# Altium project vme_can_pcb_v4.PrjPcb (part 1 of 2)
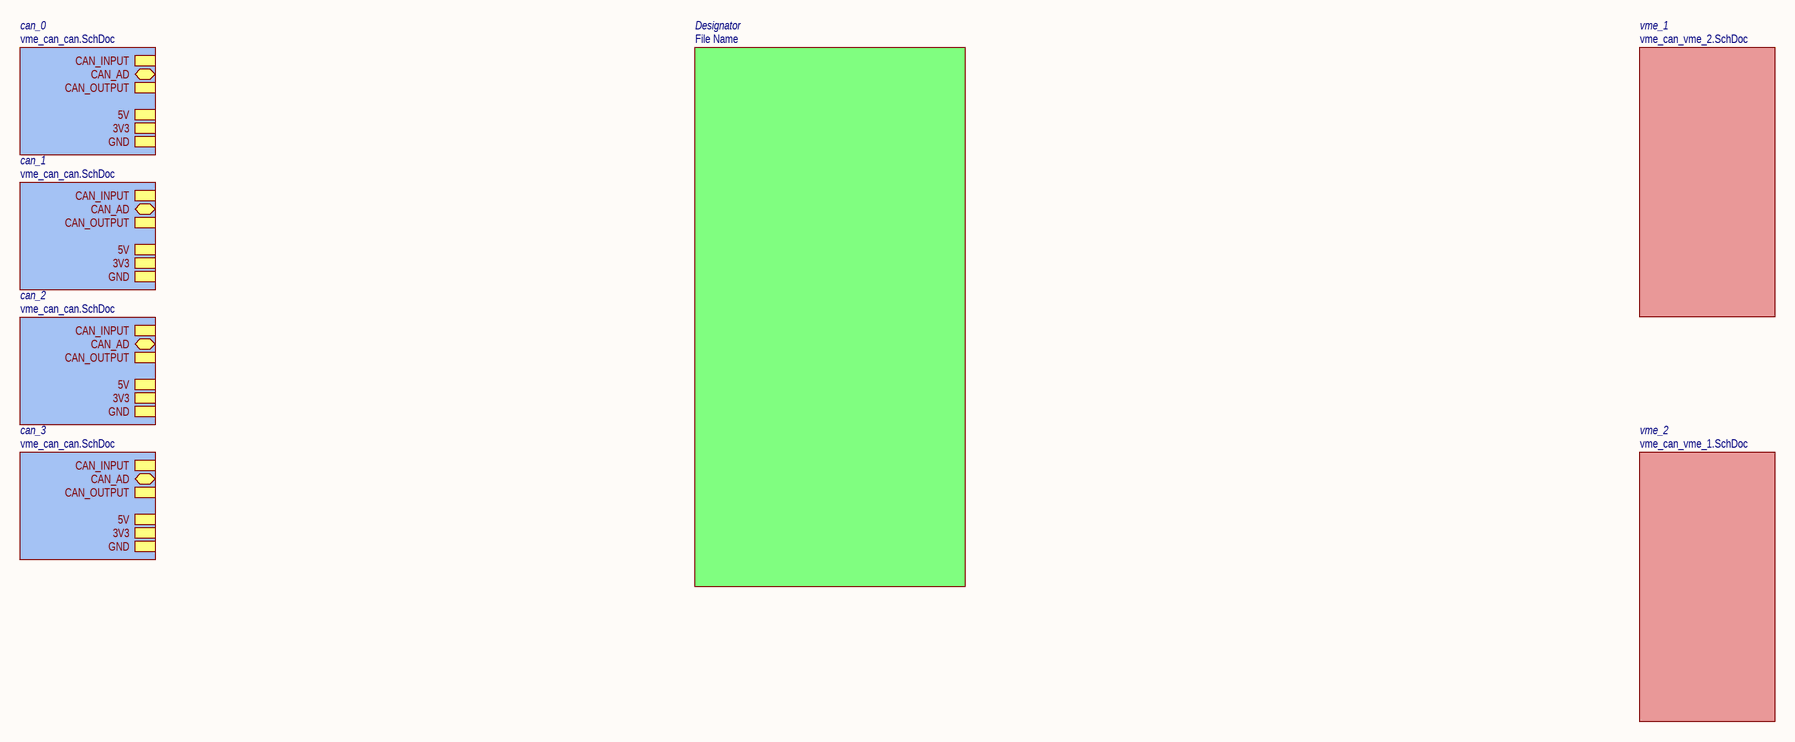
[diagram p0: vme_can_main.SchDoc]
8 sheets, 377 parts. Net scope: hierarchical (ports join the sheet entries above them; power ports are global).
Board file: vme_can.PcbDoc
Sheets:
  vme_can_main.SchDoc
    can_0 = vme_can_can.SchDoc
    can_1 = vme_can_can.SchDoc
    can_2 = vme_can_can.SchDoc
    can_3 = vme_can_can.SchDoc
    vme_1 = vme_can_vme_2.SchDoc
    vme_2 = vme_can_vme_1.SchDoc
  vme_can_fpga.SchDoc
    fpga_io = vme_can_fpga_bridge.SchDoc
    fpga_pwr = vme_can_fpga_pwr.SchDoc
    fpga_conf_per = vme_can_fpga_conf.SchDoc

## Sheet vme_can_main.SchDoc: =GlobalProjectName
size 410 x 297 mm; SheetNumber: 1; SheetTotal: 8; PageSetup: Record=PageOptions|CenterHorizontal=True|CenterVertical=True|PrintScale=1.00|XCorrection=1.00|YCorrection=1.00|PrintKind=1|BorderSize=5000000|LeftOffset=0|BottomOffset=0|Orientation=2|PaperLength=1000|PaperWidth=1000|Scale=100|PaperSource=15|PrintQuality=1200|MediaType=1|DitherType=10|PaperKind=A3|PrintScaleMode=1; Weight: -; ScaleFactor: -

### Sub-sheets
can_0 = vme_can_can.SchDoc: 5V, GND, CAN_AD (bidir), CAN_INPUT (harness FPGA_CAN_INPUT), 3V3, CAN_OUTPUT (harness FPGA_CAN_OUPUT)
can_1 = vme_can_can.SchDoc: 5V, GND, CAN_AD (bidir), CAN_INPUT (harness FPGA_CAN_INPUT), 3V3, CAN_OUTPUT (harness FPGA_CAN_OUPUT)
can_2 = vme_can_can.SchDoc: 5V, GND, CAN_AD (bidir), CAN_INPUT (harness FPGA_CAN_INPUT), 3V3, CAN_OUTPUT (harness FPGA_CAN_OUPUT)
can_3 = vme_can_can.SchDoc: 5V, GND, CAN_AD (bidir), CAN_INPUT (harness FPGA_CAN_INPUT), 3V3, CAN_OUTPUT (harness FPGA_CAN_OUPUT)
Designator = File Name (file not in this document): no entries
vme_1 = vme_can_vme_2.SchDoc: no entries
vme_2 = vme_can_vme_1.SchDoc: no entries

### Nets
3V3: sheet can_0/3V3, sheet can_1/3V3, sheet can_2/3V3, sheet can_3/3V3
5V: sheet can_0/5V, sheet can_1/5V, sheet can_2/5V, sheet can_3/5V
GND: sheet can_0/GND, sheet can_1/GND, sheet can_2/GND, sheet can_3/GND

### Notes on the sheet
- Перв. примен.
- Справ. №
- Подп. и дата
- Инв. № дубл.
- Взам. инв. №
- Изм.
- Разраб.
- Лист
- № докум.
- Подп.
- Дата
- Литера
- Масса
- Масштаб
- Пров.
- Т.контр.
- Листов
- Н.контр.
- Утв.
- Инв. № подл.
- Форма 1 ГОСТ 2.104-2006
- Копировал
- Формат А3

## Sheet vme_can_can.SchDoc: =GlobalProjectName
size 410 x 297 mm; SheetNumber: 2; SheetTotal: 8; PageSetup: Record=PageOptions|CenterHorizontal=True|CenterVertical=True|PrintScale=1.00|XCorrection=1.00|YCorrection=1.00|PrintKind=1|BorderSize=5000000|LeftOffset=0|BottomOffset=0|Orientation=2|PaperLength=1000|PaperWidth=1000|Scale=100|PaperSource=15|PrintQuality=1200|MediaType=1|DitherType=10|PaperKind=A3|PrintScaleMode=1; Weight: -; ScaleFactor: -
Used 4 times, as channels can_0, can_1, can_2, can_3. Parts and nets are listed once, with the designators drawn on the sheet.
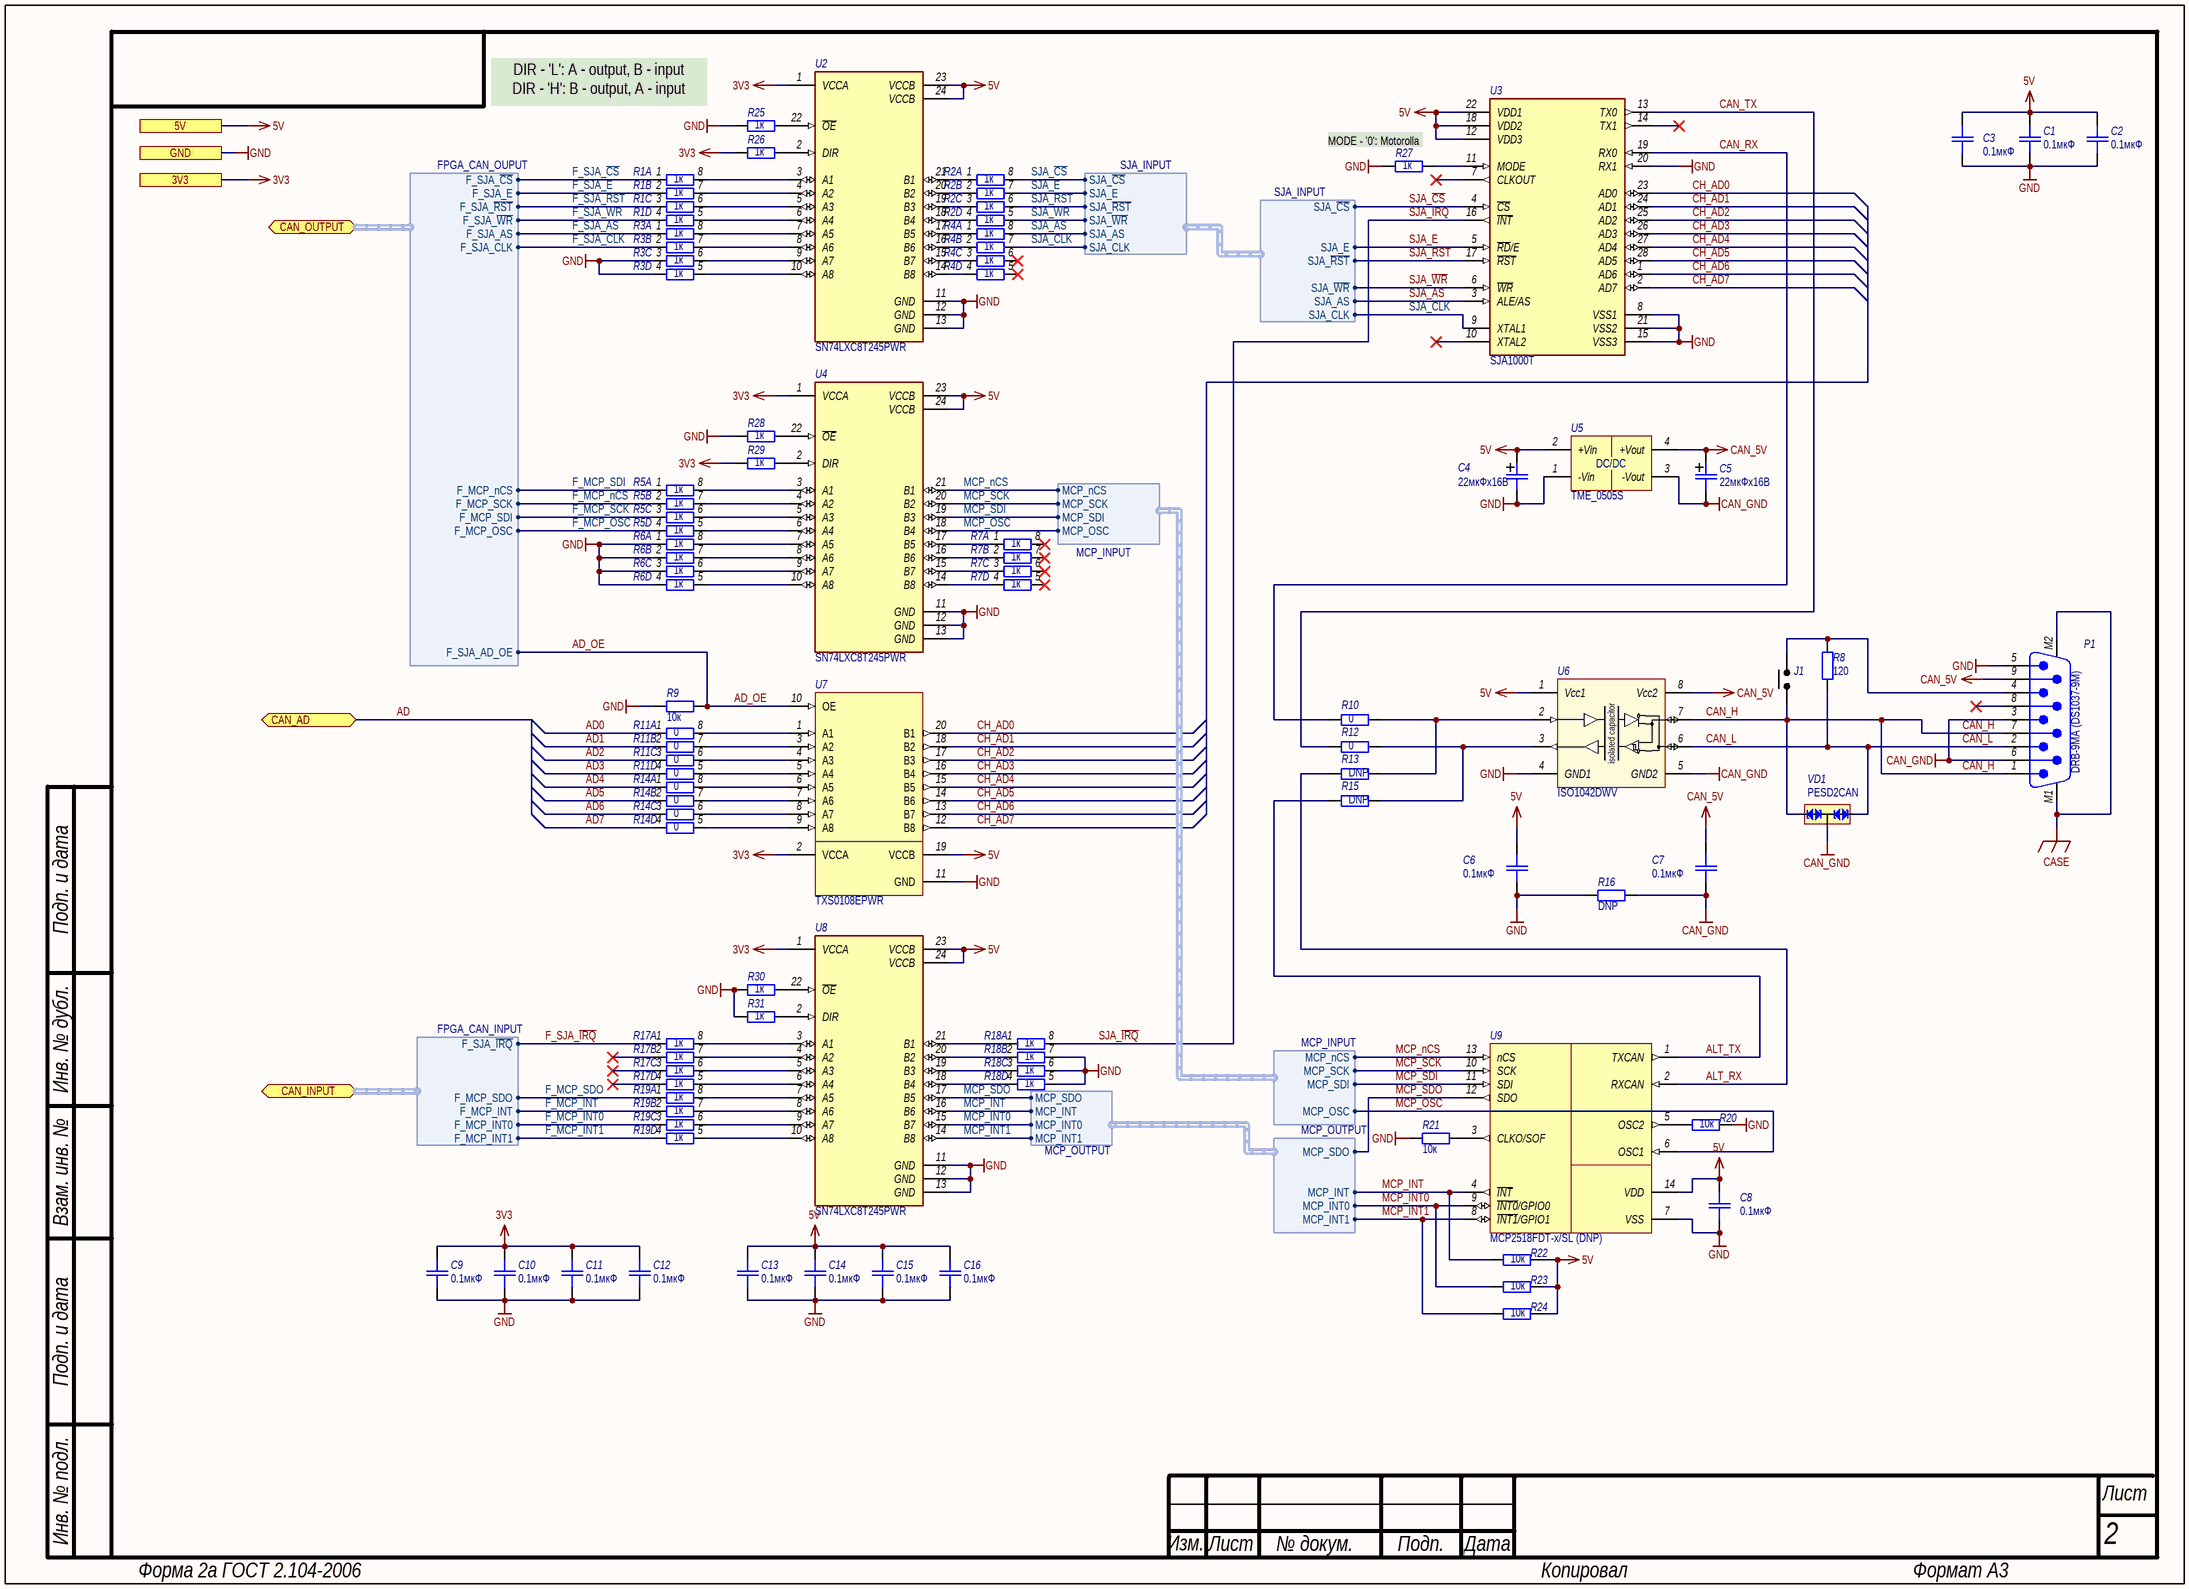
[diagram p1: vme_can_can.SchDoc]

### Parts
C1  0.1мкФ  [SMD_C0805]
C2  0.1мкФ  [SMD_C0805]
C3  0.1мкФ  [SMD_C0805]
C4  value 22мкФх16В  [SMD_size_B]  (hidden comment: OS K53-68)
C5  value 22мкФх16В  [SMD_size_B]  (hidden comment: OS K53-68)
C6  0.1мкФ  [SMD_C0805]
C7  0.1мкФ  [SMD_C0805]
C8  0.1мкФ  [SMD_C0805]
C9  0.1мкФ  [SMD_C0805]
C10  0.1мкФ  [SMD_C0805]
C11  0.1мкФ  [SMD_C0805]
C12  0.1мкФ  [SMD_C0805]
C13  0.1мкФ  [SMD_C0805]
C14  0.1мкФ  [SMD_C0805]
C15  0.1мкФ  [SMD_C0805]
C16  0.1мкФ  [SMD_C0805]
J1  Jumper 2  [PLS-2]  (value not drawn)
P1  Наименование: DRB-9MA (DS1037-9M)  [DRB-9MA]  (hidden comment: DRB-9MA)
R1  value 1к  [TC124]  (hidden comment: 4 Chip Resistor Array)  (parts A,B,C,D of 4)
R2  value 1к  [TC124]  (hidden comment: 4 Chip Resistor Array)  (parts A,B,C,D of 4)
R3  value 1к  [TC124]  (hidden comment: 4 Chip Resistor Array)  (parts A,B,C,D of 4)
R4  value 1к  [TC124]  (hidden comment: 4 Chip Resistor Array)  (parts A,B,C,D of 4)
R5  value 1к  [TC124]  (hidden comment: 4 Chip Resistor Array)  (parts A,B,C,D of 4)
R6  value 1к  [TC124]  (hidden comment: 4 Chip Resistor Array)  (parts A,B,C,D of 4)
R7  value 1к  [TC124]  (hidden comment: 4 Chip Resistor Array)  (parts A,B,C,D of 4)
R8  120  [SMD_0805]
R9  10к  [SMD_0805]
R10  0  [SMD_0805]
R11  value 0  [TC124]  (hidden comment: 4 Chip Resistor Array)  (parts A,B,C,D of 4)
R12  0  [SMD_0805]
R13  DNP  [SMD_0805]
R14  value 0  [TC124]  (hidden comment: 4 Chip Resistor Array)  (parts A,B,C,D of 4)
R15  DNP  [SMD_0805]
R16  DNP  [SMD_0805]
R17  value 1к  [TC124]  (hidden comment: 4 Chip Resistor Array)  (parts A,B,C,D of 4)
R18  value 1к  [TC124]  (hidden comment: 4 Chip Resistor Array)  (parts A,B,C,D of 4)
R19  value 1к  [TC124]  (hidden comment: 4 Chip Resistor Array)  (parts A,B,C,D of 4)
R20  10к  [SMD_0805]
R21  10к  [SMD_0805]
R22  10к  [SMD_0805]
R23  10к  [SMD_0805]
R24  10к  [SMD_0805]
R25  1к  [SMD_0805]
R26  1к  [SMD_0805]
R27  1к  [SMD_0805]
R28  1к  [SMD_0805]
R29  1к  [SMD_0805]
R30  1к  [SMD_0805]
R31  1к  [SMD_0805]
U2  SN74LXC8T245PWR  [TSSOP-24]
U3  SJA1000T  [SO28]
U4  SN74LXC8T245PWR  [TSSOP-24]
U5  TME_0505S  [PCBComponent_1]
U6  Наименование: ISO1042DWV  [SOIC-8-WIDE]  (hidden comment: ISO1042)
U7  TXS0108EPWR  [TSSOP-20]
U8  SN74LXC8T245PWR  [TSSOP-24]
U9  Наименование: MCP2518FDT-x/SL (DNP)  [SOIC-14]  (hidden comment: MCP2518FDT-x/SL)
VD1  PESD2CAN  [SOT-23]

### Ports
3V3, 5V, CAN_AD (bidir), CAN_INPUT (bidir, harness FPGA_CAN_INPUT), CAN_OUTPUT (bidir, harness FPGA_CAN_OUPUT), GND

### Harnesses
SJA_INPUT: SJA_~{CS}, SJA_E, SJA_~{RST}, SJA_~{WR}, SJA_AS, SJA_CLK
MCP_INPUT: MCP_nCS, MCP_SCK, MCP_SDI, MCP_OSC
MCP_OUTPUT: MCP_SDO, MCP_INT, MCP_INT0, MCP_INT1
FPGA_CAN_OUPUT: F_SJA_~{CS}, F_SJA_E, F_SJA_~{RST}, F_SJA_~{WR}, F_SJA_AS, F_MCP_nCS, F_MCP_SCK, F_MCP_SDI, F_SJA_AD_OE, F_MCP_OSC, F_SJA_CLK
FPGA_CAN_INPUT: F_SJA_~{IRQ}, F_MCP_SDO, F_MCP_INT, F_MCP_INT0, F_MCP_INT1

### Nets
3V3: C9.2 C10.2 C11.2 C12.2 R26.2 R29.2 U2.1(VCCA) U4.1(VCCA) U7.2(VCCA) U8.1(VCCA) ; port 3V3
5V: C1.2 C2.2 C3.2 C4.1 C6.2 C8.2 C13.2 C14.2 C15.2 C16.2 R22.1 R23.1 R24.1 U2.23(VCCB) U2.24(VCCB) U3.12(VDD3) U3.18(VDD2) U3.22(VDD1) U4.23(VCCB) U4.24(VCCB) U5.2(+Vin) U6.1(Vcc1) U7.19(VCCB) U8.23(VCCB) U8.24(VCCB) U9.14(VDD) ; port 5V
CAN_5V: C5.1 C7.2 P1.9 U5.4(+Vout) U6.8(Vcc2)
CAN_GND: C5.2 C7.1 P1.3 P1.6 R16.1 U5.3(-Vout) U6.5(GND2) VD1.3(CC)
CASE: P1.M1 P1.M2
GND: C1.1 C2.1 C3.1 C4.2 C6.1 C8.1 C9.1 C10.1 C11.1 C12.1 C13.1 C14.1 C15.1 C16.1 P1.5 R3.3 R3.4 R6.1 R6.2 R6.3 R6.4 R9.2 R16.2 R18.5 R18.6 R18.7 R20.1 R21.1 R25.2 R27.2 R28.2 R30.2 R31.2 U2.11(GND) U2.12(GND) U2.13(GND) U3.8(VSS1) U3.15(VSS3) U3.20(RX1) U3.21(VSS2) U4.11(GND) U4.12(GND) U4.13(GND) U5.1(-Vin) U6.4(GND1) U7.11(GND) U8.11(GND) U8.12(GND) U8.13(GND) U9.7(VSS) ; port GND
AD0: R11.1
AD1: R11.2
AD2: R11.3
AD3: R11.4
AD4: R14.1
AD5: R14.2
AD6: R14.3
AD7: R14.4
AD_OE: R9.1 U7.10(OE) ; port CAN_OUTPUT.F_SJA_AD_OE
ALT_RX: R13.2 U9.2(RXCAN)
ALT_TX: R15.2 U9.1(TXCAN)
CAN_H: J1.1 P1.1 P1.7 U6.7(CANH) VD1.2(C2)
CAN_L: P1.2 R8.1 U6.6(CANL) VD1.1(C1)
CAN_RX: R10.2 U3.19(RX0)
CAN_TX: R12.2 U3.13(TX0)
CH_AD0: U3.23(AD0) U7.20(B1)
CH_AD1: U3.24(AD1) U7.18(B2)
CH_AD2: U3.25(AD2) U7.17(B3)
CH_AD3: U3.26(AD3) U7.16(B4)
CH_AD4: U3.27(AD4) U7.15(B5)
CH_AD5: U3.28(AD5) U7.14(B6)
CH_AD6: U3.1(AD6) U7.13(B7)
CH_AD7: U3.2(AD7) U7.12(B8)
F_MCP_INT: R19.2 ; port CAN_INPUT.F_MCP_INT
F_MCP_INT0: R19.3 ; port CAN_INPUT.F_MCP_INT0
F_MCP_INT1: R19.4 ; port CAN_INPUT.F_MCP_INT1
F_MCP_nCS: R5.2 ; port CAN_OUTPUT.F_MCP_SCK
F_MCP_OSC: R5.4 ; port CAN_OUTPUT.F_MCP_OSC
F_MCP_SCK: R5.3 ; port CAN_OUTPUT.F_MCP_SDI
F_MCP_SDI: R5.1 ; port CAN_OUTPUT.F_MCP_nCS
F_MCP_SDO: R19.1 ; port CAN_INPUT.F_MCP_SDO
F_SJA_AS: R3.1 ; port CAN_OUTPUT.F_SJA_AS
F_SJA_~{CS}: R1.1 ; port CAN_OUTPUT.F_SJA_~{CS}
F_SJA_CLK: R3.2 ; port CAN_OUTPUT.F_SJA_CLK
F_SJA_E: R1.2 ; port CAN_OUTPUT.F_SJA_E
F_SJA_~{IRQ}: R17.1 ; port CAN_INPUT.F_SJA_~{IRQ}
F_SJA_~{RST}: R1.3 ; port CAN_OUTPUT.F_SJA_~{RST}
F_SJA_~{WR}: R1.4 ; port CAN_OUTPUT.F_SJA_~{WR}
MCP_INT: R22.2 U8.16(B6) U9.4(~{INT}) ; harness MCP_OUTPUT.MCP_INT
MCP_INT0: R23.2 U8.15(B7) U9.9(~{INT0}/GPIO0) ; harness MCP_OUTPUT.MCP_INT0
MCP_INT1: R24.2 U8.14(B8) U9.8(~{INT1}/GPIO1) ; harness MCP_OUTPUT.MCP_INT1
MCP_nCS: U4.21(B1) U9.13(nCS) ; harness MCP_INPUT.MCP_nCS
MCP_OSC: U4.18(B4) U9.6(OSC1) ; harness MCP_INPUT.MCP_OSC
MCP_SCK: U4.20(B2) U9.10(SCK) ; harness MCP_INPUT.MCP_SCK
MCP_SDI: U4.19(B3) U9.11(SDI) ; harness MCP_INPUT.MCP_SDI
MCP_SDO: U8.17(B5) U9.12(SDO) ; harness MCP_OUTPUT.MCP_SDO
SJA_AS: R4.8 U3.3(ALE/AS) ; harness SJA_INPUT.SJA_AS
SJA_~{CS}: R2.8 U3.4(~{CS}) ; harness SJA_INPUT.SJA_~{CS}
SJA_CLK: R4.7 U3.9(XTAL1) ; harness SJA_INPUT.SJA_CLK
SJA_E: R2.7 U3.5(~{RD}/E) ; harness SJA_INPUT.SJA_E
SJA_~{IRQ}: R18.8 U3.16(~{INT})
SJA_~{RST}: R2.6 U3.17(~{RST}) ; harness SJA_INPUT.SJA_~{RST}
SJA_~{WR}: R2.5 U3.6(~{WR}) ; harness SJA_INPUT.SJA_~{WR}
NetJ1_2: J1.2 P1.4 R8.2
NetR1_5: R1.5 U2.6(A4)
NetR1_6: R1.6 U2.5(A3)
NetR1_7: R1.7 U2.4(A2)
NetR1_8: R1.8 U2.3(A1)
NetR2_1: R2.1 U2.21(B1)
NetR2_2: R2.2 U2.20(B2)
NetR2_3: R2.3 U2.19(B3)
NetR2_4: R2.4 U2.18(B4)
NetR3_5: R3.5 U2.10(A8)
NetR3_6: R3.6 U2.9(A7)
NetR3_7: R3.7 U2.8(A6)
NetR3_8: R3.8 U2.7(A5)
NetR4_1: R4.1 U2.17(B5)
NetR4_2: R4.2 U2.16(B6)
NetR4_3: R4.3 U2.15(B7)
NetR4_4: R4.4 U2.14(B8)
NetR5_5: R5.5 U4.6(A4)
NetR5_6: R5.6 U4.5(A3)
NetR5_7: R5.7 U4.4(A2)
NetR5_8: R5.8 U4.3(A1)
NetR6_5: R6.5 U4.10(A8)
NetR6_6: R6.6 U4.9(A7)
NetR6_7: R6.7 U4.8(A6)
NetR6_8: R6.8 U4.7(A5)
NetR7_1: R7.1 U4.17(B5)
NetR7_2: R7.2 U4.16(B6)
NetR7_3: R7.3 U4.15(B7)
NetR7_4: R7.4 U4.14(B8)
NetR10_1: R10.1 R13.1 U6.2(TXD)
NetR11_5: R11.5 U7.5(A4)
NetR11_6: R11.6 U7.4(A3)
NetR11_7: R11.7 U7.3(A2)
NetR11_8: R11.8 U7.1(A1)
NetR12_1: R12.1 R15.1 U6.3(RXD)
NetR14_5: R14.5 U7.9(A8)
NetR14_6: R14.6 U7.8(A7)
NetR14_7: R14.7 U7.7(A6)
NetR14_8: R14.8 U7.6(A5)
NetR17_5: R17.5 U8.6(A4)
NetR17_6: R17.6 U8.5(A3)
NetR17_7: R17.7 U8.4(A2)
NetR17_8: R17.8 U8.3(A1)
NetR18_1: R18.1 U8.21(B1)
NetR18_2: R18.2 U8.20(B2)
NetR18_3: R18.3 U8.19(B3)
NetR18_4: R18.4 U8.18(B4)
NetR19_5: R19.5 U8.10(A8)
NetR19_6: R19.6 U8.9(A7)
NetR19_7: R19.7 U8.8(A6)
NetR19_8: R19.8 U8.7(A5)
NetR20_2: R20.2 U9.5(OSC2)
NetR21_2: R21.2 U9.3(CLKO/SOF)
NetR25_1: R25.1 U2.22(~{OE})
NetR26_1: R26.1 U2.2(DIR)
NetR27_1: R27.1 U3.11(MODE)
NetR28_1: R28.1 U4.22(~{OE})
NetR29_1: R29.1 U4.2(DIR)
NetR30_1: R30.1 U8.22(~{OE})
NetR31_1: R31.1 U8.2(DIR)

Not connected (* = marked no-connect by the designer): P1 8*; R4 5* 6*; R7 5* 6* 7* 8*; R17 2* 3* 4*; U3 7(CLKOUT)* 10(XTAL2)* 14(TX1)*

### Channels
can_0: designators end in _can_0; ports 3V3=3V3 5V=5V GND=GND
can_1: designators end in _can_1; ports 3V3=3V3 5V=5V GND=GND
can_2: designators end in _can_2; ports 3V3=3V3 5V=5V GND=GND
can_3: designators end in _can_3; ports 3V3=3V3 5V=5V GND=GND

### Buses and harness runs
bus AD = port CAN_AD

### Notes on the sheet
- DIR - 'L': A - output, B - input
  DIR - 'H': B - output, A - input
- (near R27) MODE - '0': Motorolla
- Подп. и дата
- Инв. № дубл.
- Взам. инв. №
- Инв. № подл.
- Изм.
- Лист
- № докум.
- Подп.
- Дата
- Форма 2а ГОСТ 2.104-2006
- Копировал
- Формат А3
- (in symbol ISO1042) isolated capacitor
- (in symbol TME_xxxxS) DC/DC

### Library data of the parts
C1-C3 C6-C16 = Capacitor: Назначение: SMD-конденсатор; Наименование: Конденсатор; Потребление, Вт: 0; Value: 0.1мкФ
C4 C5 = Capacitor_pol: Polarized capacitor; Назначение: Поляризованный SMD-конденсатор; Наименование: Танталовый конденсатор; Потребление, Вт: 0; Точность: %; Напряжение: В; Диэлектрик: *
J1 = Jumper 2: Jumper, 2-Pin, Dual row; Потребление, Вт: 0,0; Наименование: Jumper 2-pin; Назначение: Jumper, 2-Pin, Dual row
P1 = DRB-9MA: D-SUB 9 pins, Male PCB Connector with Hex Screw WR-DSUB, 8.08 mm, Angled; Manufacturer: Wurth Elektronik; Part Number: 618009231221; Working Voltage: 125VAC; Contact Resistance: 30mOhm; Rated Current: 3A; Pin Number: 9; Потребление, Вт: 0.0; Manufacturer URL: http://www.we-online.de; Orientation: Angled; Operating Temperature: -40to85degC; Package Reference: 618009231221; Gender: Male; Mounting Technology: THT; Publisher: WurthElektronik; Datasheet URL: https://katalog.we-online.de/em/datasheet/6180xx231221.pdf; Packaging: Tray; Назначение: D-SUB 9 pins, Male PCB Connector with Hex Screw WR-DSUB, 8.08 mm, Angled; ComponentLink1Description: DataSheet; ComponentLink1URL: http://outer.connfly.group/static/upload/file/pdf/DS1037-02.pdf
R1-R7 R11 R14 R17-R19 = Resistor-4: Потребление, Вт: 0.0; Назначение: 4 Chip Resistor Array; Наименование: 4 Chip Resistor Array
R8-R10 R12 R13 R15 R16 R20-R31 = Resistor: Наименование: Резистор; Назначение: SMD-резистор; Потребление, Вт: 0,001
  R8: Value: 120
  R9 R20-R24: Value: 10к
  R10 R12: Value: 0
  R13 R15 R16: Value: DNP
  R25-R31: Value: 1к
U2 U4 U8 = SN74LXC8T245PWR: Dual-Supply Bus Transceiver with Configurable Level Shifting / and 3-State Outputs; Потрбление, Вт: 0.01; ComponentLink2Description: Datasheet; ComponentLink2URL: http://www.ti.com/lit/ds/symlink/sn74lxc8t245.pdf; Назначение: Dual-Supply Bus Transceiver with Configurable Level Shifting; Наименование: SN74LXC8T245PWR
U3 = SJA1000: IC STAND-ALONE CAN CTRLR 28-SOIC; Manufacturer Part Number: SJA1000T/N1,118; Manufacturer: NXP Semiconductors; Standoff Height: 0.1mm; Interface: Parallel,CAN; Max Supply Voltage: 5.5V; Min Supply Voltage: 4.5V; Nominal Supply Current: 15mA; Потрбление, Вт: 0.075; Ipc Land Pattern Name: SOIC127P1032X265-28; Device Class L2: Interface ICs; Ambient Temperature Range High: +125°C; Temperature Range High: +125°C; Device Class L3: Controllers; Automotive: No; Octopart: https://octopart.com/sja1000t%2Fn1%2C118-nxp+semiconductors-9518151; Height: 2.65mm; Package: SOT136-1; Digikey Description: IC STAND-ALONE CAN CTRLR 28-SOIC; ComponentLink2Description: Datasheet; Footprint Url: https://www.nxp.com/docs/en/package-information/SOT136-1.pdf; Device Class L1: Integrated Circuits (ICs); ComponentLink2URL: https://www.nxp.com/docs/en/data-sheet/SJA1000.pdf; Lead Free: Yes; RoHS: TRUE; Category: IC; Mouser Description: Network Controller & Processor ICs STAND ALONE CAN; Temperature: -40°C to +125°C; Ambient Temperature Range Low: -40°C; Temperature Range Low: -40°C; Назначение: IC STAND-ALONE CAN CTRLR 28-SOIC; Наименование: SJA1000T
U5 = TME_xxxxS: DC-DC, 1W, Fixed input voltage, isolated & unregulated single output; Потребление, Вт: 0.2; Назначение: DC-DC, 1W, Fixed input voltage, isolated & unregulated single output; ComponentLink1Description: DataSheet; ComponentLink1URL: https://static.chipdip.ru/lib/672/DOC011672083.pdf; Supplier 1: Digi-Key; Supplier Part Number 1: 1951-2746-ND; Наименование: TME_0505S
U6 = ISO1042: Isolated CAN Transceiver; Назначение: Изолированный CAN приемник; Потребление, Вт: 0,001; ComponentLink1Description: DataSheet; ComponentLink1URL: https://www.ti.com/lit/ds/symlink/iso1042.pdf?ts=1596792765962&ref_url=https%253A%252F%252Fwww.ti.com%252Fproduct%252FISO1042
U7 = TXS0108EPWR: 8-Bit Bi-directional, Level-Shifting, Voltage Translator / for Open-Drain and Push-Pull Applications; Потребление, Вт: 0.001; Назначение: 8-Bit Bi-directional, Level-Shifting, Voltage Translator; ComponentLink1Description: DataSheet; ComponentLink1URL: https://www.ti.com/lit/ds/symlink/txs0108e.pdf?ts=1638170700951&ref_url=https%253A%252F%252Fwww.google.ru%252F; Наименование: TXS0108EPWR
U9 = MCP2518FDT-x_SL: CAN FD Controller with SPI Interface; Потрбление, Вт: 0.1; Назначение: CAN FD Controller with SPI Interface; ComponentLink1Description: DataSheet; ComponentLink1URL: https://ww1.microchip.com/downloads/en/DeviceDoc/External-CAN-FD-Controller-with-SPI-Interface-DS20006027B.pdf
VD1 = PESD2CAN: CAN bus ESD protection diode; Назначение: Защитная диодная сборка CAN-шины от ЭСР; Потребление, Вт: 0,001; ComponentLink1Description: DataSheet; ComponentLink1URL: https://docviewer.yandex.ru/view/20572601/?*=RQqn8Wj9g8uNyA%2Fh5vLXNATrwhl7InVybCI6Imh0dHBzOi8vYXNzZXRzLm5leHBlcmlhLmNvbS9kb2N1bWVudHMvZGF0YS1zaGVldC9QRVNEMkNBTi5wZGYiLCJ0aXRsZSI6IlBFU0QyQ0FOLnBkZiIsIm5vaWZyYW1lIjp0cnVlLCJ1aWQiOiIyMDU3MjYwMSIsInRzIjoxNTk2Nzk0OTE4Njc4LCJ5dSI6Ijg4OTA2MTMzMTU0MzM4NzEyMSIsInNlcnBQYXJhbXMiOiJsYW5nPWVuJnRtPTE1OTY3OTQ4OTAmdGxkPXJ1Jm5hbWU9UEVTRDJDQU4ucGRmJnRleHQ9cGVzZDJjYW4mdXJsPWh0dHBzJTNBLy9hc3NldHMubmV4cGVyaWEuY29tL2RvY3VtZW50cy9kYXRhLXNoZWV0L1BFU0QyQ0FOLnBkZiZscj02NSZtaW1lPXBkZiZsMTBuPXJ1JnNpZ249MzE3ZjE4NzU1MTcwMWNmYmI4ZDQxYzc2OTNlYTFkYzIma2V5bm89MCJ9&lang=en; Наименование: PESD2CAN

## Sheet vme_can_vme_2.SchDoc: =GlobalProjectName
size 410 x 297 mm; SheetNumber: 3; SheetTotal: 8; PageSetup: Record=PageOptions|CenterHorizontal=True|CenterVertical=True|PrintScale=1.00|XCorrection=1.00|YCorrection=1.00|PrintKind=1|BorderSize=5000000|LeftOffset=0|BottomOffset=0|Orientation=2|PaperLength=1000|PaperWidth=1000|Scale=100|PaperSource=15|PrintQuality=1200|MediaType=1|DitherType=10|PaperKind=A3|PrintScaleMode=1; Weight: -; ScaleFactor: -
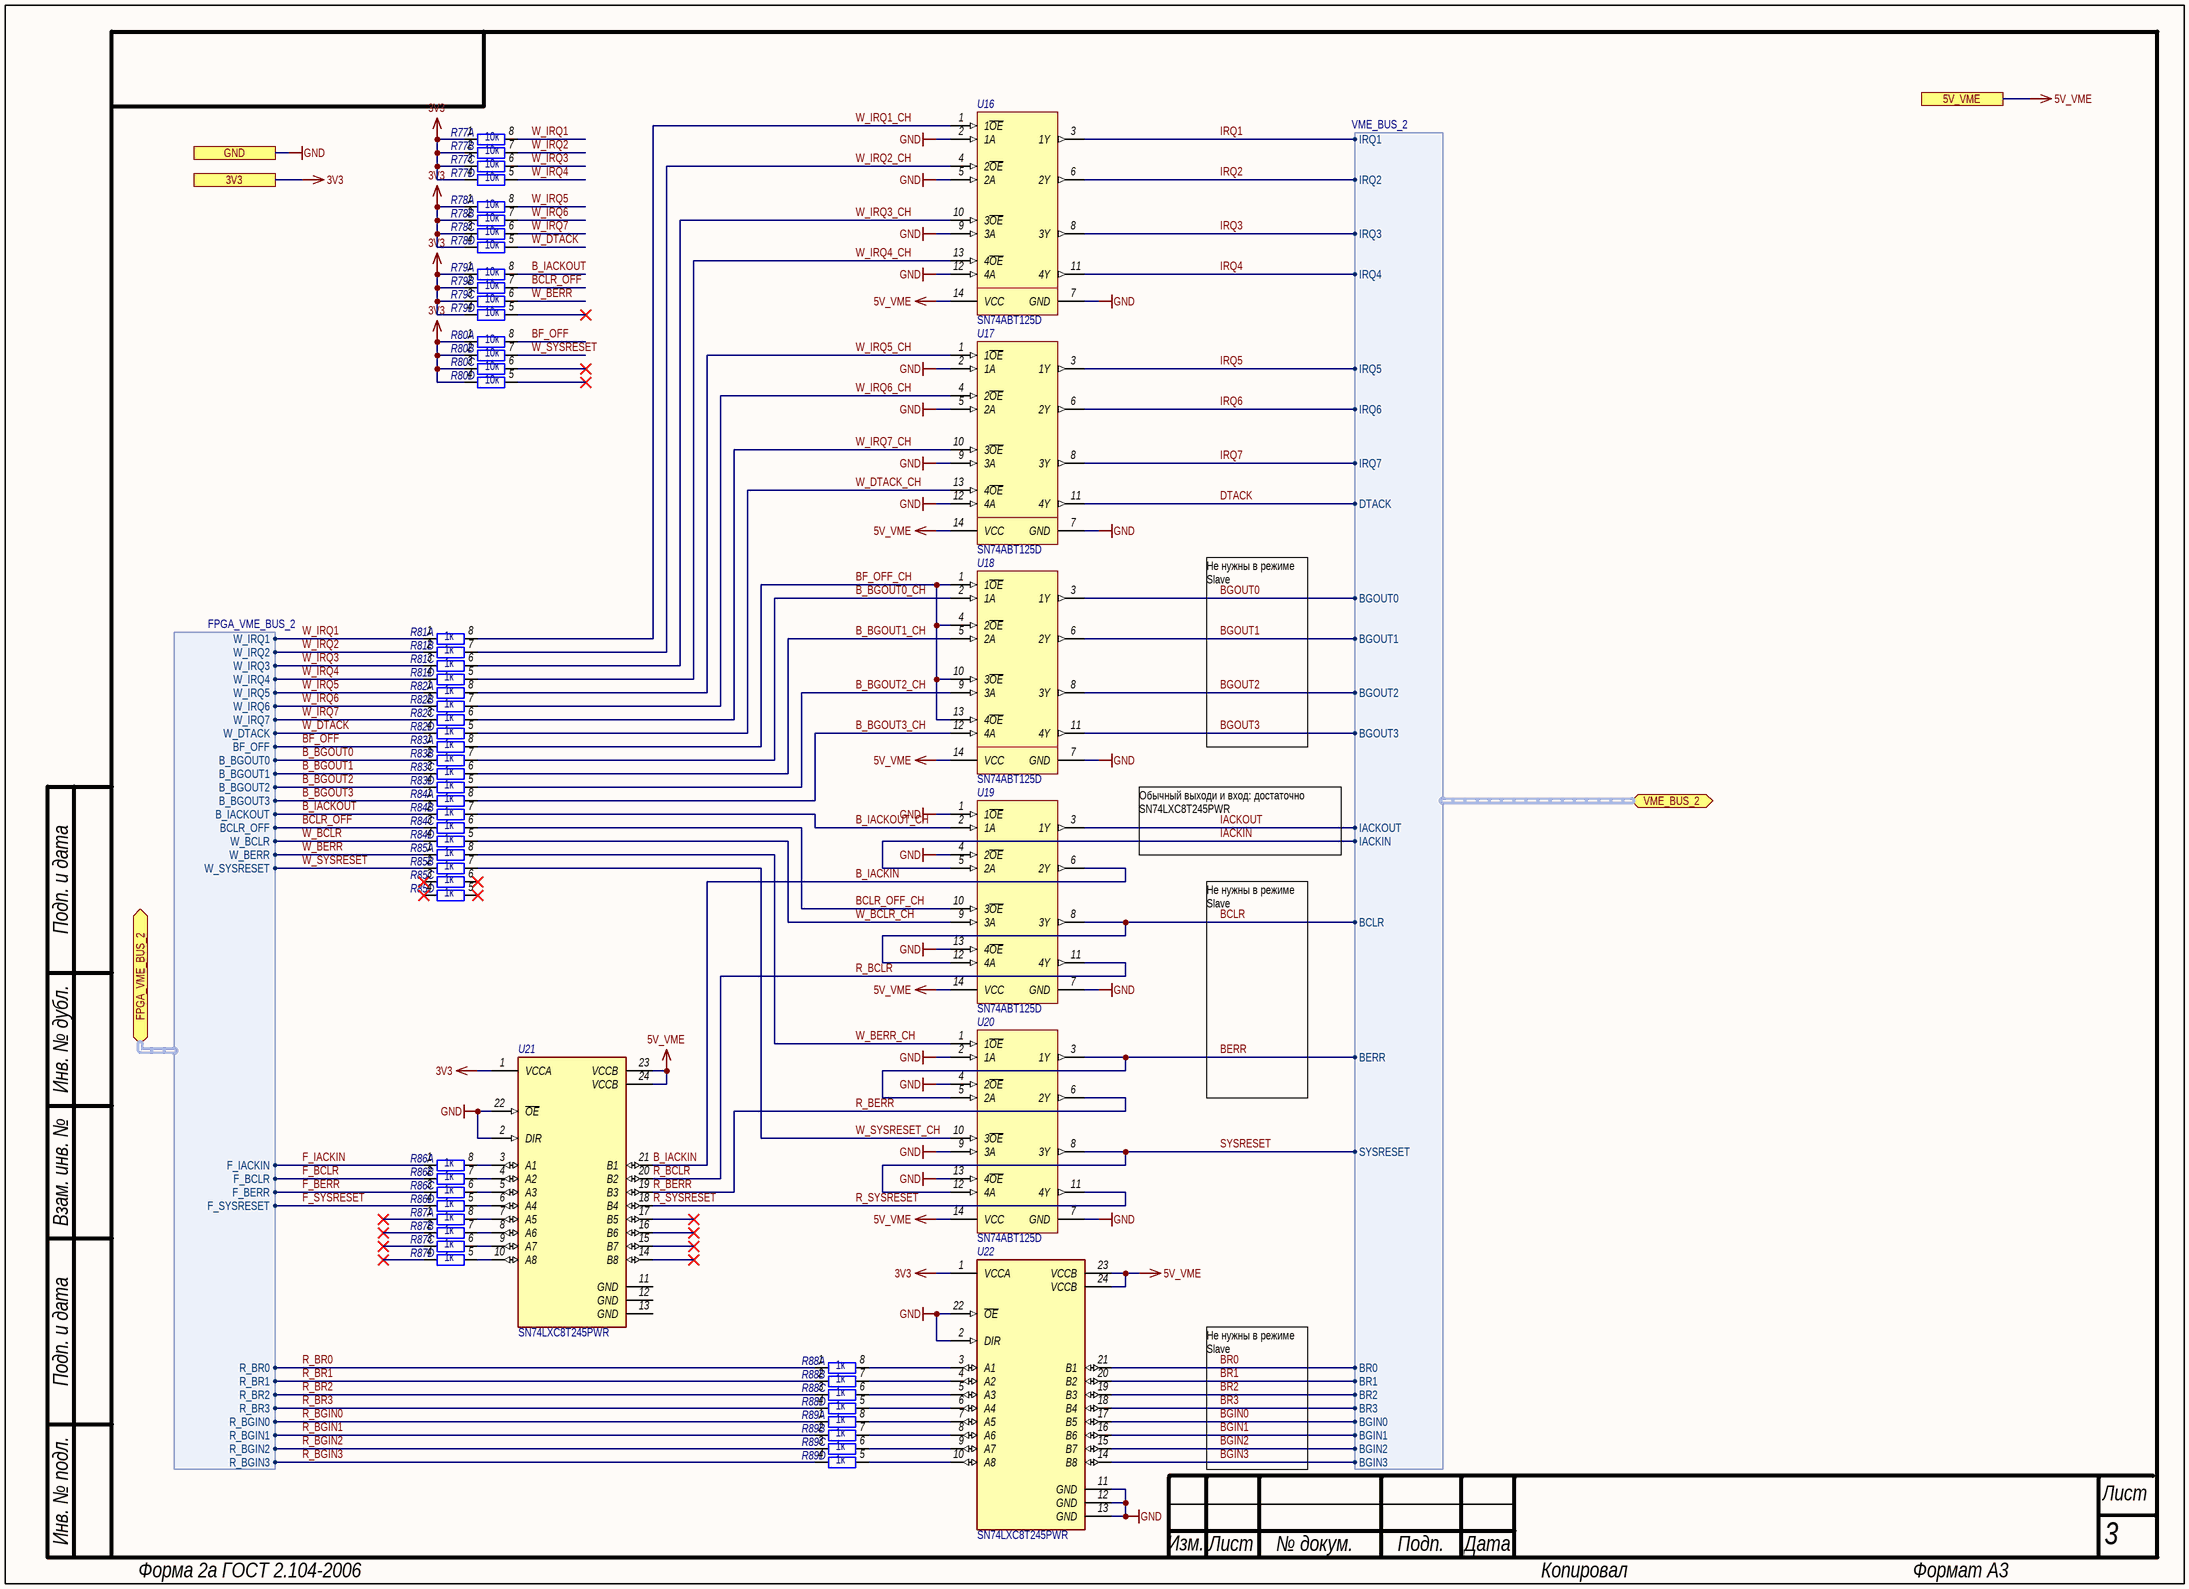
[diagram p2: vme_can_vme_2.SchDoc]

### Parts
R77  value 10к  [TC124]  (hidden comment: 4 Chip Resistor Array)  (parts A,B,C,D of 4)
R78  value 10к  [TC124]  (hidden comment: 4 Chip Resistor Array)  (parts A,B,C,D of 4)
R79  value 10к  [TC124]  (hidden comment: 4 Chip Resistor Array)  (parts A,B,C,D of 4)
R80  value 10к  [TC124]  (hidden comment: 4 Chip Resistor Array)  (parts A,B,C,D of 4)
R81  value 1к  [TC124]  (hidden comment: 4 Chip Resistor Array)  (parts A,B,C,D of 4)
R82  value 1к  [TC124]  (hidden comment: 4 Chip Resistor Array)  (parts A,B,C,D of 4)
R83  value 1к  [TC124]  (hidden comment: 4 Chip Resistor Array)  (parts A,B,C,D of 4)
R84  value 1к  [TC124]  (hidden comment: 4 Chip Resistor Array)  (parts A,B,C,D of 4)
R85  value 1к  [TC124]  (hidden comment: 4 Chip Resistor Array)  (parts A,B,C,D of 4)
R86  value 1к  [TC124]  (hidden comment: 4 Chip Resistor Array)  (parts A,B,C,D of 4)
R87  value 1к  [TC124]  (hidden comment: 4 Chip Resistor Array)  (parts A,B,C,D of 4)
R88  value 1к  [TC124]  (hidden comment: 4 Chip Resistor Array)  (parts A,B,C,D of 4)
R89  value 1к  [TC124]  (hidden comment: 4 Chip Resistor Array)  (parts A,B,C,D of 4)
U16  SN74ABT125D  [SOIC-14]
U17  SN74ABT125D  [SOIC-14]
U18  SN74ABT125D  [SOIC-14]
U19  SN74ABT125D  [SOIC-14]
U20  SN74ABT125D  [SOIC-14]
U21  SN74LXC8T245PWR  [TSSOP-24]
U22  SN74LXC8T245PWR  [TSSOP-24]

### Ports
3V3, 5V_VME, FPGA_VME_BUS_2 (bidir, harness FPGA_VME_BUS_2), GND, VME_BUS_2 (bidir, harness VME_BUS_2)

### Harnesses
VME_BUS_2: IRQ1, IRQ2, IRQ3, IRQ4, IRQ5, IRQ6, IRQ7, DTACK, BGOUT0, BGOUT1, BGOUT2, BGOUT3, IACKOUT, IACKIN, BCLR, BERR, SYSRESET, BR0, BR1, BR2, BR3, BGIN0, BGIN1, BGIN2, BGIN3
FPGA_VME_BUS_2: W_IRQ1, W_IRQ2, W_IRQ3, W_IRQ4, W_IRQ5, W_IRQ6, W_IRQ7, W_DTACK, BF_OFF, B_BGOUT0, B_BGOUT1, B_BGOUT2, B_BGOUT3, B_IACKOUT, BCLR_OFF, W_BCLR, W_BERR, W_SYSRESET, F_IACKIN, F_BCLR, F_BERR, F_SYSRESET, R_BR0, R_BR1, R_BR2, R_BR3, R_BGIN0, R_BGIN1, R_BGIN2, R_BGIN3

### Nets
3V3: R77.1 R77.2 R77.3 R77.4 R78.1 R78.2 R78.3 R78.4 R79.1 R79.2 R79.3 R79.4 R80.1 R80.2 R80.3 R80.4 U21.1(VCCA) U22.1(VCCA) ; port 3V3
5V_VME: U16.14(VCC) U17.14(VCC) U18.14(VCC) U19.14(VCC) U20.14(VCC) U21.23(VCCB) U21.24(VCCB) U22.23(VCCB) U22.24(VCCB) ; port 5V_VME
GND: U16.2(1A) U16.5(2A) U16.7(GND) U16.9(3A) U16.12(4A) U17.2(1A) U17.5(2A) U17.7(GND) U17.9(3A) U17.12(4A) U18.7(GND) U19.1(1~{OE}) U19.4(2~{OE}) U19.7(GND) U19.13(4~{OE}) U20.2(1A) U20.4(2~{OE}) U20.7(GND) U20.9(3A) U20.13(4~{OE}) U21.2(DIR) U21.22(~{OE}) U22.2(DIR) U22.11(GND) U22.12(GND) U22.13(GND) U22.22(~{OE}) ; port GND
B_BGOUT0: R83.2 ; port FPGA_VME_BUS_2.B_BGOUT0
B_BGOUT0_CH: R83.7 U18.2(1A)
B_BGOUT1: R83.3 ; port FPGA_VME_BUS_2.B_BGOUT1
B_BGOUT1_CH: R83.6 U18.5(2A)
B_BGOUT2: R83.4 ; port FPGA_VME_BUS_2.B_BGOUT2
B_BGOUT2_CH: R83.5 U18.9(3A)
B_BGOUT3: R84.1 ; port FPGA_VME_BUS_2.B_BGOUT3
B_BGOUT3_CH: R84.8 U18.12(4A)
B_IACKIN: U19.6(2Y) U21.21(B1)
B_IACKOUT: R79.8 R84.2 ; port FPGA_VME_BUS_2.B_IACKOUT
B_IACKOUT_CH: R84.7 U19.2(1A)
BCLR: U19.8(3Y) U19.12(4A) ; port VME_BUS_2.BCLR
BCLR_OFF: R79.7 R84.3 ; port FPGA_VME_BUS_2.BCLR_OFF
BCLR_OFF_CH: R84.6 U19.10(3~{OE})
BERR: U20.3(1Y) U20.5(2A) ; port VME_BUS_2.BERR
BF_OFF: R80.8 R83.1 ; port FPGA_VME_BUS_2.BF_OFF
BF_OFF_CH: R83.8 U18.1(1~{OE}) U18.4(2~{OE}) U18.10(3~{OE}) U18.13(4~{OE})
BGIN0: U22.17(B5) ; port VME_BUS_2.BGIN0
BGIN1: U22.16(B6) ; port VME_BUS_2.BGIN1
BGIN2: U22.15(B7) ; port VME_BUS_2.BGIN2
BGIN3: U22.14(B8) ; port VME_BUS_2.BGIN3
BGOUT0: U18.3(1Y) ; port VME_BUS_2.BGOUT0
BGOUT1: U18.6(2Y) ; port VME_BUS_2.BGOUT1
BGOUT2: U18.8(3Y) ; port VME_BUS_2.BGOUT2
BGOUT3: U18.11(4Y) ; port VME_BUS_2.BGOUT3
BR0: U22.21(B1) ; port VME_BUS_2.BR0
BR1: U22.20(B2) ; port VME_BUS_2.BR1
BR2: U22.19(B3) ; port VME_BUS_2.BR2
BR3: U22.18(B4) ; port VME_BUS_2.BR3
DTACK: U17.11(4Y) ; port VME_BUS_2.DTACK
F_BCLR: R86.2 ; port FPGA_VME_BUS_2.F_BCLR
F_BERR: R86.3 ; port FPGA_VME_BUS_2.F_BERR
F_IACKIN: R86.1 ; port FPGA_VME_BUS_2.F_IACKIN
F_SYSRESET: R86.4 ; port FPGA_VME_BUS_2.F_SYSRESET
IACKIN: U19.5(2A) ; port VME_BUS_2.IACKIN
IACKOUT: U19.3(1Y) ; port VME_BUS_2.IACKOUT
IRQ1: U16.3(1Y) ; port VME_BUS_2.IRQ1
IRQ2: U16.6(2Y) ; port VME_BUS_2.IRQ2
IRQ3: U16.8(3Y) ; port VME_BUS_2.IRQ3
IRQ4: U16.11(4Y) ; port VME_BUS_2.IRQ4
IRQ5: U17.3(1Y) ; port VME_BUS_2.IRQ5
IRQ6: U17.6(2Y) ; port VME_BUS_2.IRQ6
IRQ7: U17.8(3Y) ; port VME_BUS_2.IRQ7
R_BCLR: U19.11(4Y) U21.20(B2)
R_BERR: U20.6(2Y) U21.19(B3)
R_BGIN0: R89.1 ; port FPGA_VME_BUS_2.R_BGIN0
R_BGIN1: R89.2 ; port FPGA_VME_BUS_2.R_BGIN1
R_BGIN2: R89.3 ; port FPGA_VME_BUS_2.R_BGIN2
R_BGIN3: R89.4 ; port FPGA_VME_BUS_2.R_BGIN3
R_BR0: R88.1 ; port FPGA_VME_BUS_2.R_BR0
R_BR1: R88.2 ; port FPGA_VME_BUS_2.R_BR1
R_BR2: R88.3 ; port FPGA_VME_BUS_2.R_BR2
R_BR3: R88.4 ; port FPGA_VME_BUS_2.R_BR3
R_SYSRESET: U20.11(4Y) U21.18(B4)
SYSRESET: U20.8(3Y) U20.12(4A) ; port VME_BUS_2.SYSRESET
W_BCLR: R84.4 ; port FPGA_VME_BUS_2.W_BCLR
W_BCLR_CH: R84.5 U19.9(3A)
W_BERR: R79.6 R85.1 ; port FPGA_VME_BUS_2.W_BERR
W_BERR_CH: R85.8 U20.1(1~{OE})
W_DTACK: R78.5 R82.4 ; port FPGA_VME_BUS_2.W_DTACK
W_DTACK_CH: R82.5 U17.13(4~{OE})
W_IRQ1: R77.8 R81.1 ; port FPGA_VME_BUS_2.W_IRQ1
W_IRQ1_CH: R81.8 U16.1(1~{OE})
W_IRQ2: R77.7 R81.2 ; port FPGA_VME_BUS_2.W_IRQ2
W_IRQ2_CH: R81.7 U16.4(2~{OE})
W_IRQ3: R77.6 R81.3 ; port FPGA_VME_BUS_2.W_IRQ3
W_IRQ3_CH: R81.6 U16.10(3~{OE})
W_IRQ4: R77.5 R81.4 ; port FPGA_VME_BUS_2.W_IRQ4
W_IRQ4_CH: R81.5 U16.13(4~{OE})
W_IRQ5: R78.8 R82.1 ; port FPGA_VME_BUS_2.W_IRQ5
W_IRQ5_CH: R82.8 U17.1(1~{OE})
W_IRQ6: R78.7 R82.2 ; port FPGA_VME_BUS_2.W_IRQ6
W_IRQ6_CH: R82.7 U17.4(2~{OE})
W_IRQ7: R78.6 R82.3 ; port FPGA_VME_BUS_2.W_IRQ7
W_IRQ7_CH: R82.6 U17.10(3~{OE})
W_SYSRESET: R80.7 R85.2 ; port FPGA_VME_BUS_2.W_SYSRESET
W_SYSRESET_CH: R85.7 U20.10(3~{OE})
NetR86_5: R86.5 U21.6(A4)
NetR86_6: R86.6 U21.5(A3)
NetR86_7: R86.7 U21.4(A2)
NetR86_8: R86.8 U21.3(A1)
NetR87_5: R87.5 U21.10(A8)
NetR87_6: R87.6 U21.9(A7)
NetR87_7: R87.7 U21.8(A6)
NetR87_8: R87.8 U21.7(A5)
NetR88_5: R88.5 U22.6(A4)
NetR88_6: R88.6 U22.5(A3)
NetR88_7: R88.7 U22.4(A2)
NetR88_8: R88.8 U22.3(A1)
NetR89_5: R89.5 U22.10(A8)
NetR89_6: R89.6 U22.9(A7)
NetR89_7: R89.7 U22.8(A6)
NetR89_8: R89.8 U22.7(A5)

Not connected (* = marked no-connect by the designer): R79 5*; R80 5* 6*; R85 3* 4* 5* 6*; R87 1* 2* 3* 4*; U21 11(GND) 12(GND) 13(GND) 14(B8)* 15(B7)* 16(B6)* 17(B5)*

### Notes on the sheet
- Не нужны в режиме Slave
- Обычный выходи и вход: достаточно SN74LXC8T245PWR
- Подп. и дата
- Инв. № дубл.
- Взам. инв. №
- Инв. № подл.
- Изм.
- Лист
- № докум.
- Подп.
- Дата
- Форма 2а ГОСТ 2.104-2006
- Копировал
- Формат А3

### Library data of the parts
R77-R89 = Resistor-4: Потребление, Вт: 0.0; Назначение: 4 Chip Resistor Array; Наименование: 4 Chip Resistor Array
U16-U20 = SN74ABT125D: QUADRUPLE BUS BUFFER GATES; Потребление, Вт: 0.15; Назначение: QUADRUPLE BUS BUFFER GATES; ComponentLink1Description: DataSheet; ComponentLink1URL: https://www.ti.com/lit/ds/scbs182i/scbs182i.pdf; Наименование: SN74ABT125D
U21 U22 = SN74LXC8T245PWR: as U2 on sheet vme_can_can; ComponentLink2Description: Datasheet; ComponentLink2URL: http://www.ti.com/lit/ds/symlink/sn74lxc8t245.pdf; Назначение: Dual-Supply Bus Transceiver with Configurable Level Shifting; Наименование: SN74LXC8T245PWR

## Sheet vme_can_vme_1.SchDoc: =GlobalProjectName
size 410 x 297 mm; SheetNumber: 8; SheetTotal: 8; PageSetup: Record=PageOptions|CenterHorizontal=True|CenterVertical=True|PrintScale=1.00|XCorrection=1.00|YCorrection=1.00|PrintKind=1|BorderSize=5000000|LeftOffset=0|BottomOffset=0|Orientation=2|PaperLength=1000|PaperWidth=1000|Scale=100|PaperSource=15|PrintQuality=1200|MediaType=1|DitherType=10|PaperKind=A3|PrintScaleMode=1; Weight: -; ScaleFactor: -
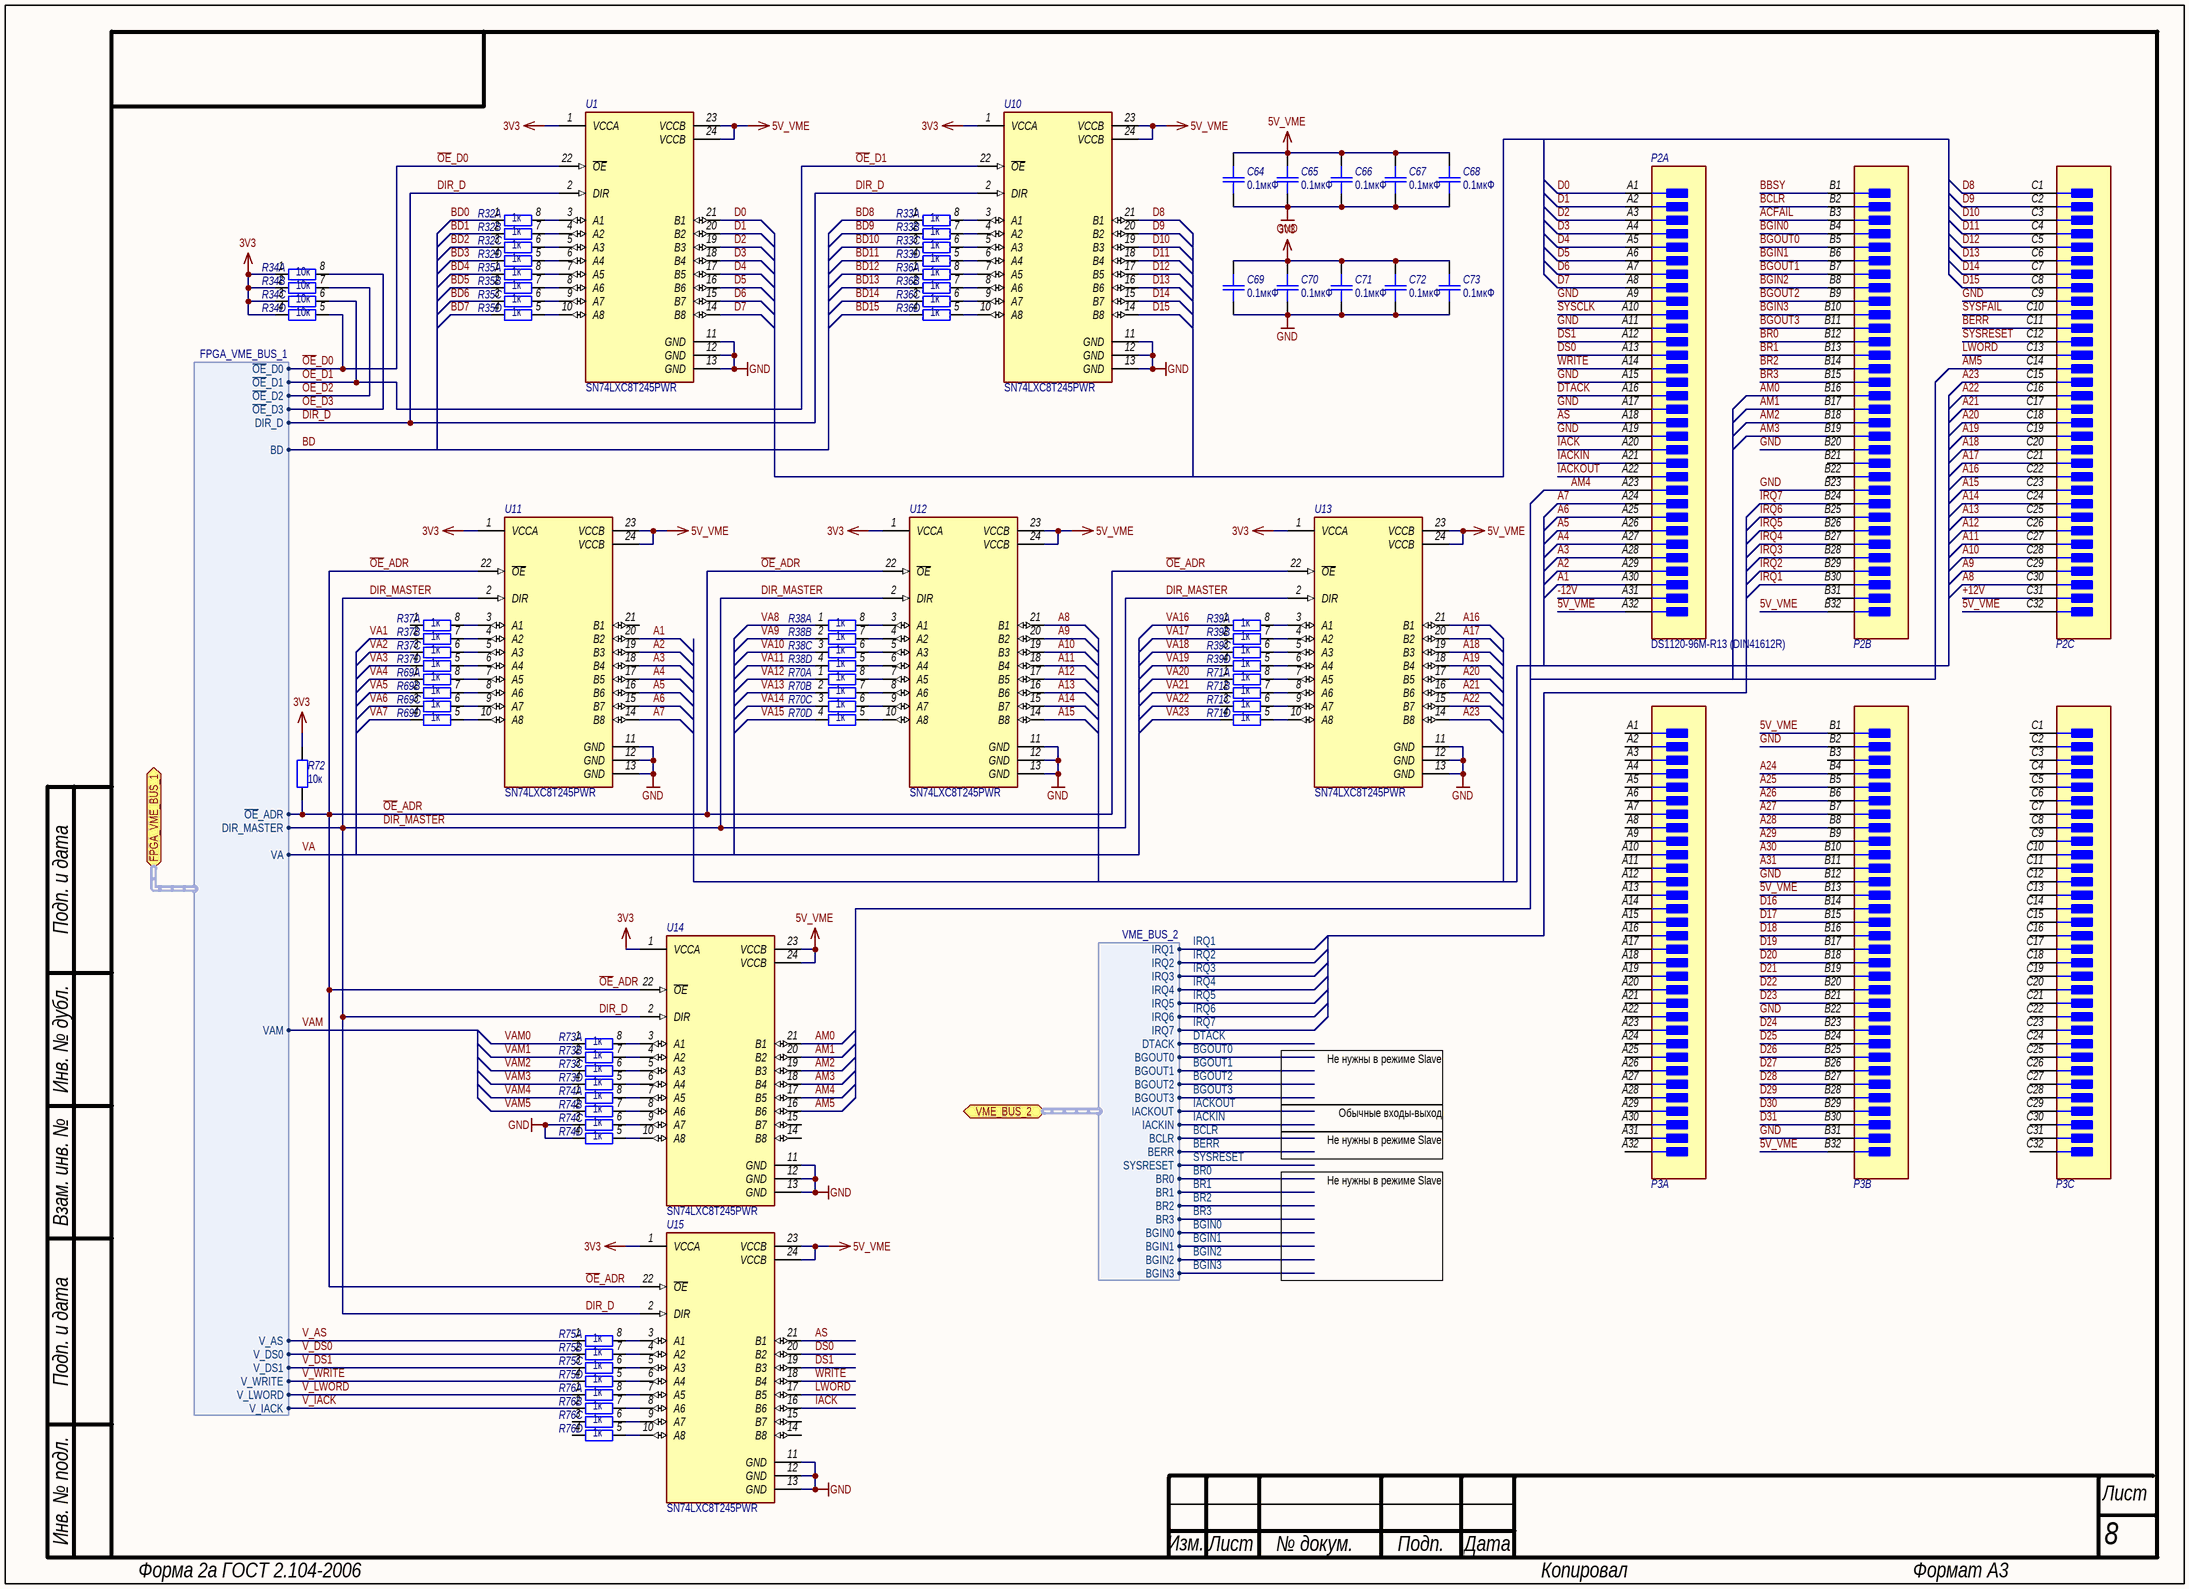
[diagram p3: vme_can_vme_1.SchDoc]

### Parts
C64  0.1мкФ  [SMD_C0805]
C65  0.1мкФ  [SMD_C0805]
C66  0.1мкФ  [SMD_C0805]
C67  0.1мкФ  [SMD_C0805]
C68  0.1мкФ  [SMD_C0805]
C69  0.1мкФ  [SMD_C0805]
C70  0.1мкФ  [SMD_C0805]
C71  0.1мкФ  [SMD_C0805]
C72  0.1мкФ  [SMD_C0805]
C73  0.1мкФ  [SMD_C0805]
P2  DS1120-96M-R13 (DIN41612R)  [DS1120-96M-R13]  (parts A,B,C of 3)
P3  DS1120-96M-R13 (DIN41612R)  [DS1120-96M-R13]  (value not drawn)  (parts A,B,C of 3)
R32  value 1к  [TC124]  (hidden comment: 4 Chip Resistor Array)  (parts A,B,C,D of 4)
R33  value 1к  [TC124]  (hidden comment: 4 Chip Resistor Array)  (parts A,B,C,D of 4)
R34  value 10к  [TC124]  (hidden comment: 4 Chip Resistor Array)  (parts A,B,C,D of 4)
R35  value 1к  [TC124]  (hidden comment: 4 Chip Resistor Array)  (parts A,B,C,D of 4)
R36  value 1к  [TC124]  (hidden comment: 4 Chip Resistor Array)  (parts A,B,C,D of 4)
R37  value 1к  [TC124]  (hidden comment: 4 Chip Resistor Array)  (parts A,B,C,D of 4)
R38  value 1к  [TC124]  (hidden comment: 4 Chip Resistor Array)  (parts A,B,C,D of 4)
R39  value 1к  [TC124]  (hidden comment: 4 Chip Resistor Array)  (parts A,B,C,D of 4)
R69  value 1к  [TC124]  (hidden comment: 4 Chip Resistor Array)  (parts A,B,C,D of 4)
R70  value 1к  [TC124]  (hidden comment: 4 Chip Resistor Array)  (parts A,B,C,D of 4)
R71  value 1к  [TC124]  (hidden comment: 4 Chip Resistor Array)  (parts A,B,C,D of 4)
R72  10к  [SMD_0805]
R73  value 1к  [TC124]  (hidden comment: 4 Chip Resistor Array)  (parts A,B,C,D of 4)
R74  value 1к  [TC124]  (hidden comment: 4 Chip Resistor Array)  (parts A,B,C,D of 4)
R75  value 1к  [TC124]  (hidden comment: 4 Chip Resistor Array)  (parts A,B,C,D of 4)
R76  value 1к  [TC124]  (hidden comment: 4 Chip Resistor Array)  (parts A,B,C,D of 4)
U1  SN74LXC8T245PWR  [TSSOP-24]
U10  SN74LXC8T245PWR  [TSSOP-24]
U11  SN74LXC8T245PWR  [TSSOP-24]
U12  SN74LXC8T245PWR  [TSSOP-24]
U13  SN74LXC8T245PWR  [TSSOP-24]
U14  SN74LXC8T245PWR  [TSSOP-24]
U15  SN74LXC8T245PWR  [TSSOP-24]

### Ports
FPGA_VME_BUS_1 (bidir, harness FPGA_VME_BUS_1), VME_BUS_2 (bidir, harness VME_BUS_2)

### Harnesses
VME_BUS_2: IRQ1, IRQ2, IRQ3, IRQ4, IRQ5, IRQ6, IRQ7, DTACK, BGOUT0, BGOUT1, BGOUT2, BGOUT3, IACKOUT, IACKIN, BCLR, BERR, SYSRESET, BR0, BR1, BR2, BR3, BGIN0, BGIN1, BGIN2, BGIN3
FPGA_VME_BUS_1: ~{OE}_D0, ~{OE}_D1, ~{OE}_D2, ~{OE}_D3, DIR_D, BD, ~{OE}_ADR, DIR_MASTER, VA, VAM, V_AS, V_DS0, V_DS1, V_WRITE, V_LWORD, V_IACK

### Nets
3V3: C69.2 C70.2 C71.2 C72.2 C73.2 R34.1 R34.2 R34.3 R34.4 R72.2 U1.1(VCCA) U10.1(VCCA) U11.1(VCCA) U12.1(VCCA) U13.1(VCCA) U14.1(VCCA) U15.1(VCCA)
5V_VME: C64.2 C65.2 C66.2 C67.2 C68.2 P2.A32 P2.B32 P2.C32 P3.B1 P3.B13 P3.B32 U1.23(VCCB) U1.24(VCCB) U10.23(VCCB) U10.24(VCCB) U11.23(VCCB) U11.24(VCCB) U12.23(VCCB) U12.24(VCCB) U13.23(VCCB) U13.24(VCCB) U14.23(VCCB) U14.24(VCCB) U15.23(VCCB) U15.24(VCCB)
GND: C64.1 C65.1 C66.1 C67.1 C68.1 C69.1 C70.1 C71.1 C72.1 C73.1 P2.A9 P2.A11 P2.A15 P2.A17 P2.A19 P2.B20 P2.B23 P2.C9 P3.B2 P3.B12 P3.B22 P3.B31 R74.3 R74.4 U1.11(GND) U1.12(GND) U1.13(GND) U10.11(GND) U10.12(GND) U10.13(GND) U11.11(GND) U11.12(GND) U11.13(GND) U12.11(GND) U12.12(GND) U12.13(GND) U13.11(GND) U13.12(GND) U13.13(GND) U14.11(GND) U14.12(GND) U14.13(GND) U15.11(GND) U15.12(GND) U15.13(GND)
+12V: P2.C31
-12V: P2.A31
A1: P2.A30 U11.20(B2)
A2: P2.A29 U11.19(B3)
A3: P2.A28 U11.18(B4)
A4: P2.A27 U11.17(B5)
A5: P2.A26 U11.16(B6)
A6: P2.A25 U11.15(B7)
A7: P2.A24 U11.14(B8)
A8: P2.C30 U12.21(B1)
A9: P2.C29 U12.20(B2)
A10: P2.C28 U12.19(B3)
A11: P2.C27 U12.18(B4)
A12: P2.C26 U12.17(B5)
A13: P2.C25 U12.16(B6)
A14: P2.C24 U12.15(B7)
A15: P2.C23 U12.14(B8)
A16: P2.C22 U13.21(B1)
A17: P2.C21 U13.20(B2)
A18: P2.C20 U13.19(B3)
A19: P2.C19 U13.18(B4)
A20: P2.C18 U13.17(B5)
A21: P2.C17 U13.16(B6)
A22: P2.C16 U13.15(B7)
A23: P2.C15 U13.14(B8)
A24: P3.B4
A25: P3.B5
A26: P3.B6
A27: P3.B7
A28: P3.B8
A29: P3.B9
A30: P3.B10
A31: P3.B11
ACFAIL: P2.B3
AM0: P2.B16 U14.21(B1)
AM1: P2.B17 U14.20(B2)
AM2: P2.B18 U14.19(B3)
AM3: P2.B19 U14.18(B4)
AM4: P2.A23 U14.17(B5)
AM5: P2.C14 U14.16(B6)
AS: P2.A18 U15.21(B1)
BBSY: P2.B1
BCLR: P2.B2 ; port VME_BUS_2.BCLR
BD0: R32.1
BD1: R32.2
BD2: R32.3
BD3: R32.4
BD4: R35.1
BD5: R35.2
BD6: R35.3
BD7: R35.4
BD8: R33.1
BD9: R33.2
BD10: R33.3
BD11: R33.4
BD12: R36.1
BD13: R36.2
BD14: R36.3
BD15: R36.4
BERR: P2.C11 ; port VME_BUS_2.BERR
BGIN0: P2.B4 ; port VME_BUS_2.BGIN0
BGIN1: P2.B6 ; port VME_BUS_2.BGIN1
BGIN2: P2.B8 ; port VME_BUS_2.BGIN2
BGIN3: P2.B10 ; port VME_BUS_2.BGIN3
BGOUT0: P2.B5 ; port VME_BUS_2.BGOUT0
BGOUT1: P2.B7 ; port VME_BUS_2.BGOUT1
BGOUT2: P2.B9 ; port VME_BUS_2.BGOUT2
BGOUT3: P2.B11 ; port VME_BUS_2.BGOUT3
BR0: P2.B12 ; port VME_BUS_2.BR0
BR1: P2.B13 ; port VME_BUS_2.BR1
BR2: P2.B14 ; port VME_BUS_2.BR2
BR3: P2.B15 ; port VME_BUS_2.BR3
D0: P2.A1 U1.21(B1)
D1: P2.A2 U1.20(B2)
D2: P2.A3 U1.19(B3)
D3: P2.A4 U1.18(B4)
D4: P2.A5 U1.17(B5)
D5: P2.A6 U1.16(B6)
D6: P2.A7 U1.15(B7)
D7: P2.A8 U1.14(B8)
D8: P2.C1 U10.21(B1)
D9: P2.C2 U10.20(B2)
D10: P2.C3 U10.19(B3)
D11: P2.C4 U10.18(B4)
D12: P2.C5 U10.17(B5)
D13: P2.C6 U10.16(B6)
D14: P2.C7 U10.15(B7)
D15: P2.C8 U10.14(B8)
D16: P3.B14
D17: P3.B15
D18: P3.B16
D19: P3.B17
D20: P3.B18
D21: P3.B19
D22: P3.B20
D23: P3.B21
D24: P3.B23
D25: P3.B24
D26: P3.B25
D27: P3.B26
D28: P3.B27
D29: P3.B28
D30: P3.B29
D31: P3.B30
DIR_D: U1.2(DIR) U10.2(DIR) U11.2(DIR) U12.2(DIR) U13.2(DIR) U14.2(DIR) U15.2(DIR) ; port FPGA_VME_BUS_1.DIR_D, port FPGA_VME_BUS_1.DIR_MASTER  [also labelled DIR_MASTER]
DS0: P2.A13 U15.20(B2)
DS1: P2.A12 U15.19(B3)
DTACK: P2.A16 ; port VME_BUS_2.DTACK
IACK: P2.A20 U15.16(B6)
IACKIN: P2.A21 ; port VME_BUS_2.IACKIN
IACKOUT: P2.A22 ; port VME_BUS_2.IACKOUT
IRQ1: P2.B30 ; port VME_BUS_2.IRQ1
IRQ2: P2.B29 ; port VME_BUS_2.IRQ2
IRQ3: P2.B28 ; port VME_BUS_2.IRQ3
IRQ4: P2.B27 ; port VME_BUS_2.IRQ4
IRQ5: P2.B26 ; port VME_BUS_2.IRQ5
IRQ6: P2.B25 ; port VME_BUS_2.IRQ6
IRQ7: P2.B24 ; port VME_BUS_2.IRQ7
LWORD: P2.C13 U15.17(B5)
~{OE}_ADR: R72.1 U11.22(~{OE}) U12.22(~{OE}) U13.22(~{OE}) U14.22(~{OE}) U15.22(~{OE}) ; port FPGA_VME_BUS_1.~{OE}_ADR
~{OE}_D0: R34.5 U1.22(~{OE}) ; port FPGA_VME_BUS_1.~{OE}_D0
~{OE}_D1: R34.6 U10.22(~{OE}) ; port FPGA_VME_BUS_1.~{OE}_D1
~{OE}_D2: R34.7 ; port FPGA_VME_BUS_1.~{OE}_D2
~{OE}_D3: R34.8 ; port FPGA_VME_BUS_1.~{OE}_D3
SYSCLK: P2.A10
SYSFAIL: P2.C10
SYSRESET: P2.C12 ; port VME_BUS_2.SYSRESET
V_AS: R75.1 ; port FPGA_VME_BUS_1.V_AS
V_DS0: R75.2 ; port FPGA_VME_BUS_1.V_DS0
V_DS1: R75.3 ; port FPGA_VME_BUS_1.V_DS1
V_IACK: R76.2 ; port FPGA_VME_BUS_1.V_IACK
V_LWORD: R76.1 ; port FPGA_VME_BUS_1.V_LWORD
V_WRITE: R75.4 ; port FPGA_VME_BUS_1.V_WRITE
VA1: R37.2
VA2: R37.3
VA3: R37.4
VA4: R69.1
VA5: R69.2
VA6: R69.3
VA7: R69.4
VA8: R38.1
VA9: R38.2
VA10: R38.3
VA11: R38.4
VA12: R70.1
VA13: R70.2
VA14: R70.3
VA15: R70.4
VA16: R39.1
VA17: R39.2
VA18: R39.3
VA19: R39.4
VA20: R71.1
VA21: R71.2
VA22: R71.3
VA23: R71.4
VAM0: R73.1
VAM1: R73.2
VAM2: R73.3
VAM3: R73.4
VAM4: R74.1
VAM5: R74.2
WRITE: P2.A14 U15.18(B4)
NetR32_5: R32.5 U1.6(A4)
NetR32_6: R32.6 U1.5(A3)
NetR32_7: R32.7 U1.4(A2)
NetR32_8: R32.8 U1.3(A1)
NetR33_5: R33.5 U10.6(A4)
NetR33_6: R33.6 U10.5(A3)
NetR33_7: R33.7 U10.4(A2)
NetR33_8: R33.8 U10.3(A1)
NetR35_5: R35.5 U1.10(A8)
NetR35_6: R35.6 U1.9(A7)
NetR35_7: R35.7 U1.8(A6)
NetR35_8: R35.8 U1.7(A5)
NetR36_5: R36.5 U10.10(A8)
NetR36_6: R36.6 U10.9(A7)
NetR36_7: R36.7 U10.8(A6)
NetR36_8: R36.8 U10.7(A5)
NetR37_5: R37.5 U11.6(A4)
NetR37_6: R37.6 U11.5(A3)
NetR37_7: R37.7 U11.4(A2)
NetR37_8: R37.8 U11.3(A1)
NetR38_5: R38.5 U12.6(A4)
NetR38_6: R38.6 U12.5(A3)
NetR38_7: R38.7 U12.4(A2)
NetR38_8: R38.8 U12.3(A1)
NetR39_5: R39.5 U13.6(A4)
NetR39_6: R39.6 U13.5(A3)
NetR39_7: R39.7 U13.4(A2)
NetR39_8: R39.8 U13.3(A1)
NetR69_5: R69.5 U11.10(A8)
NetR69_6: R69.6 U11.9(A7)
NetR69_7: R69.7 U11.8(A6)
NetR69_8: R69.8 U11.7(A5)
NetR70_5: R70.5 U12.10(A8)
NetR70_6: R70.6 U12.9(A7)
NetR70_7: R70.7 U12.8(A6)
NetR70_8: R70.8 U12.7(A5)
NetR71_5: R71.5 U13.10(A8)
NetR71_6: R71.6 U13.9(A7)
NetR71_7: R71.7 U13.8(A6)
NetR71_8: R71.8 U13.7(A5)
NetR73_5: R73.5 U14.6(A4)
NetR73_6: R73.6 U14.5(A3)
NetR73_7: R73.7 U14.4(A2)
NetR73_8: R73.8 U14.3(A1)
NetR74_5: R74.5 U14.10(A8)
NetR74_6: R74.6 U14.9(A7)
NetR74_7: R74.7 U14.8(A6)
NetR74_8: R74.8 U14.7(A5)
NetR75_5: R75.5 U15.6(A4)
NetR75_6: R75.6 U15.5(A3)
NetR75_7: R75.7 U15.4(A2)
NetR75_8: R75.8 U15.3(A1)
NetR76_5: R76.5 U15.10(A8)
NetR76_6: R76.6 U15.9(A7)
NetR76_7: R76.7 U15.8(A6)
NetR76_8: R76.8 U15.7(A5)

Not connected (* = marked no-connect by the designer): P2 B21 B22 B31; P3 A1 A2 A3 A4 A5 A6 A7 A8 A9 A10 A11 A12 A13 A14 A15 A16 A17 A18 A19 A20 A21 A22 A23 A24 A25 A26 A27 A28 A29 A30 A31 A32 B3 C1 C2 C3 C4 C5 C6 C7 C8 C9 C10 C11 C12 C13 C14 C15 C16 C17 C18 C19 C20 C21 C22 C23 C24 C25 C26 C27 C28 C29 C30 C31 C32; R37 1; R76 3 4; U11 21(B1); U14 14(B8) 15(B7); U15 14(B8) 15(B7)

### Buses and harness runs
bus BD
bus VA
bus VAM

### Notes on the sheet
- Не нужны в режиме Slave
- Обычные входы-выход
- Подп. и дата
- Инв. № дубл.
- Взам. инв. №
- Инв. № подл.
- Изм.
- Лист
- № докум.
- Подп.
- Дата
- Форма 2а ГОСТ 2.104-2006
- Копировал
- Формат А3

### Library data of the parts
C64-C73 = Capacitor: as C1 on sheet vme_can_can; Value: 0.1мкФ
P2 P3 = DS1120-96M-R13: Conn Backplane PL 96 POS 2.54mm Solder RA Thru-Hole Box; Manufacturer: TE; Manufacturer Part Number: 5650473-5; Conn Gender: Male; Number Of Contacts: 96; Current Rating: 1.5A; Conn Orientation: Right Angle; Voltage Rating: 250V; Потребление, Вт: 0.0; ComponentLink2URL: http://outer.connfly.group/static/upload/file/pdf/DS1119.pdf; RoHS: TRUE; Lead Free: Yes; Package: 5650473-5; Number Of Rows: 3; Device Class L3: unset; Contact Material: Gold,Nickel; Device Class L1: Connectors; Footprint Url: https://www.te.com/commerce/DocumentDelivery/DDEController?Action=showdoc&DocId=Customer+Drawing%7F5650473%7FC%7Fpdf%7FEnglish%7FENG_CD_5650473_C.pdf%7F5650473-5; Temperature: -55°C to +105°C; ComponentLink2Description: Datasheet; Device Class L2: Backplane Connectors; Category: Conn; Height: 11.1mm; Octopart: https://octopart.com/5650473-5-te+connectivity-39687507; Pitch: 2.54mm; Digikey Description: CONN DIN PLUG 96POS PCB RA GOLD; Mouser Description: Conn DIN 41612 PIN 96 POS 2.54mm Solder RA Thru-Hole Box; Temperature Range Low: -55°C; Automotive: No; Temperature Range High: +105°C; Назначение: Conn Backplane PL 96 POS 2.54mm Solder RA Thru-Hole Box; Наименование: DS1120-96M-R13 (DIN41612R)
R32-R39 R69-R71 R73-R76 = Resistor-4: Потребление, Вт: 0.0; Назначение: 4 Chip Resistor Array; Наименование: 4 Chip Resistor Array
R72 = Resistor: as R8 on sheet vme_can_can; Value: 10к
U1 U10-U15 = SN74LXC8T245PWR: as U2 on sheet vme_can_can; ComponentLink2Description: Datasheet; ComponentLink2URL: http://www.ti.com/lit/ds/symlink/sn74lxc8t245.pdf; Назначение: Dual-Supply Bus Transceiver with Configurable Level Shifting; Наименование: SN74LXC8T245PWR

## Sheet vme_can_fpga.SchDoc: =GlobalProjectName
size 410 x 297 mm; SheetNumber: 4; SheetTotal: 7; PageSetup: Record=PageOptions|CenterHorizontal=True|CenterVertical=True|PrintScale=1.00|XCorrection=1.00|YCorrection=1.00|PrintKind=1|BorderSize=5000000|LeftOffset=0|BottomOffset=0|Orientation=2|PaperLength=1000|PaperWidth=1000|Scale=100|PaperSource=15|PrintQuality=1200|MediaType=1|DitherType=10|PaperKind=A3|PrintScaleMode=1; Weight: -; ScaleFactor: -
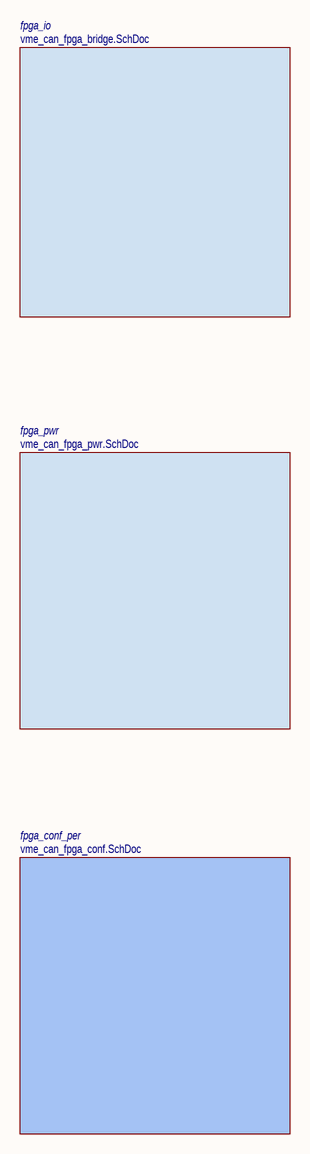
[diagram p4: vme_can_fpga.SchDoc]

### Sub-sheets
fpga_conf_per = vme_can_fpga_conf.SchDoc: no entries
fpga_io = vme_can_fpga_bridge.SchDoc: no entries
fpga_pwr = vme_can_fpga_pwr.SchDoc: no entries

### Notes on the sheet
- Подп. и дата
- Инв. № дубл.
- Взам. инв. №
- Инв. № подл.
- Изм.
- Лист
- № докум.
- Подп.
- Дата
- Форма 2а ГОСТ 2.104-2006
- Копировал
- Формат А3